# Altium schematic sheet Sensor.SchDoc: Transiently Powered Computers
size Letter; Author: Hrishikesh Jayakumar; DrawnBy: 2; Engineer: Hrishikesh; Organization: Embedded Systems Lab; Address1: 465 Northwestern Avenue; Address2: ECE Dept; Address3: Purdue University; Address4: West Lafayette, IN 47907; DocumentNumber: 6; Revision: B; SheetNumber: 6; SheetTotal: 6; DocumentName: ISHIDDEN=T
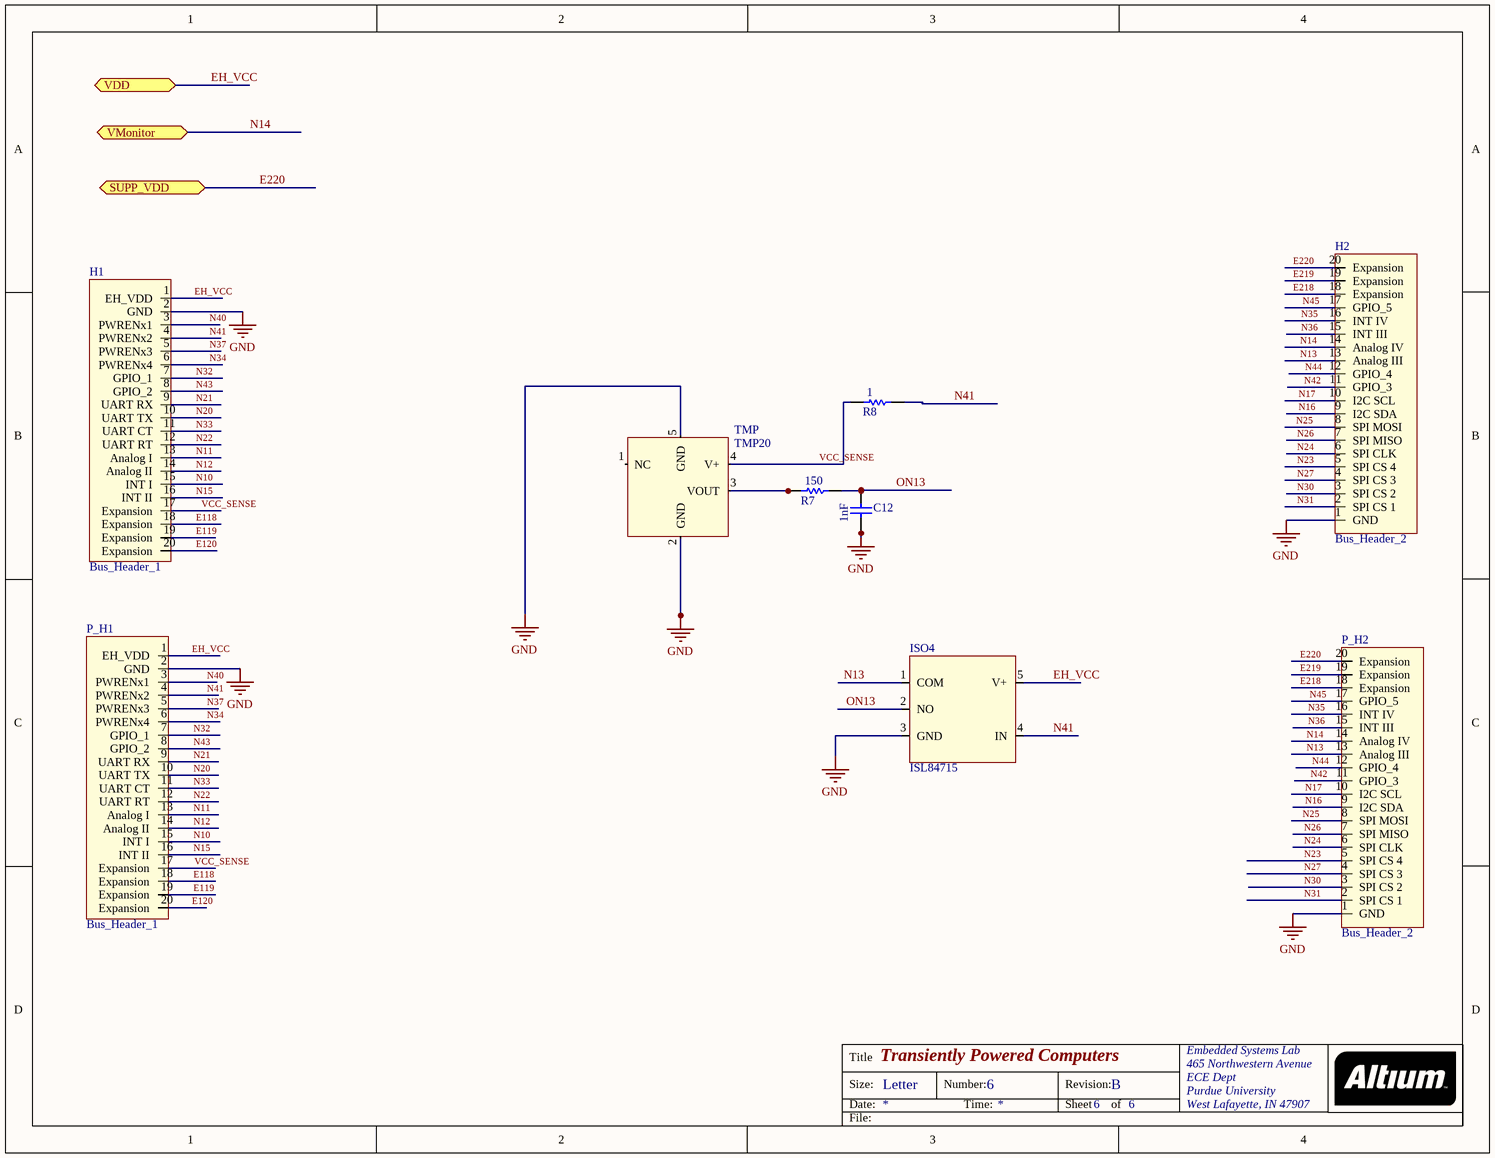
[diagram p0: Sensor.SchDoc]

## Parts
C12  value 1nF  [CAPC0402(1005)60_N]  (hidden comment: CAP 1uF 4V 0402(1005))
H1  Bus_Header_1  [Male Single row 20 pin header]
H2  Bus_Header_2  [Male Single row 20 pin header]
ISO4  ISL84715  [ISL84715]
P_H1  Bus_Header_1  [SMT 20 -pin single row female header]
P_H2  Bus_Header_2  [SMT 20 -pin single row female header]
R7  value 150  [RESC0805(2012)_M]  (hidden comment: 3R3 5% 0805(2012))
R8  value 1  [RESC0805(2012)_M]  (hidden comment: 3R3 5% 0805(2012))
TMP  TMP20  [TMP20]

## Ports
SUPP_VDD, VDD (bidir), VMonitor (bidir)

## Nets
GND: C12.1 H1.2(GND) H2.1(GND) ISO4.3(GND) P_H1.2(GND) P_H2.1(GND) TMP.2(GND) TMP.5(GND)
E118: H1.18(Expansion) P_H1.18(Expansion)
E119: H1.19(Expansion) P_H1.19(Expansion)
E120: H1.20(Expansion) P_H1.20(Expansion)
E218: H2.18(Expansion) P_H2.18(Expansion)
E219: H2.19(Expansion) P_H2.19(Expansion)
E220: H2.20(Expansion) P_H2.20(Expansion) ; port SUPP_VDD
EH_VCC: H1.1(EH_VDD) ISO4.5(V+) P_H1.1(EH_VDD) ; port VDD
N10: H1.15(INT_I) P_H1.15(INT_I)
N11: H1.13(Analog_I) P_H1.13(Analog_I)
N12: H1.14(Analog_II) P_H1.14(Analog_II)
N13: H2.13(Analog_III) ISO4.1(COM) P_H2.13(Analog_III)
N14: H2.14(Analog_IV) P_H2.14(Analog_IV) ; port VMonitor
N15: H1.16(INT_II) P_H1.16(INT_II)
N16: H2.9(I2C_SDA) P_H2.9(I2C_SDA)
N17: H2.10(I2C_SCL) P_H2.10(I2C_SCL)
N20: H1.10(UART_TX) P_H1.10(UART_TX)
N21: H1.9(UART_RX) P_H1.9(UART_RX)
N22: H1.12(UART_RT) P_H1.12(UART_RT)
N23: H2.5(SPI_CS_4) P_H2.5(SPI_CS_4)
N24: H2.6(SPI_CLK) P_H2.6(SPI_CLK)
N25: H2.8(SPI_MOSI) P_H2.8(SPI_MOSI)
N26: H2.7(SPI_MISO) P_H2.7(SPI_MISO)
N27: H2.4(SPI_CS_3) P_H2.4(SPI_CS_3)
N30: H2.3(SPI_CS_2) P_H2.3(SPI_CS_2)
N31: H2.2(SPI_CS_1) P_H2.2(SPI_CS_1)
N32: H1.7(GPIO_1) P_H1.7(GPIO_1)
N33: H1.11(UART_CT) P_H1.11(UART_CT)
N34: H1.6(PWRENx4) P_H1.6(PWRENx4)
N35: H2.16(INT_IV) P_H2.16(INT_IV)
N36: H2.15(INT_III) P_H2.15(INT_III)
N37: H1.5(PWRENx3) P_H1.5(PWRENx3)
N40: H1.3(PWRENx1) P_H1.3(PWRENx1)
N41: H1.4(PWRENx2) ISO4.4(IN) P_H1.4(PWRENx2) R8.1
N42: H2.11(GPIO_3) P_H2.11(GPIO_3)
N43: H1.8(GPIO_2) P_H1.8(GPIO_2)
N44: H2.12(GPIO_4) P_H2.12(GPIO_4)
N45: H2.17(GPIO_5) P_H2.17(GPIO_5)
ON13: C12.2 ISO4.2(NO) R7.1
VCC_SENSE: H1.17(Expansion) P_H1.17(Expansion) R8.2 TMP.4(V+)
NetR7_2: R7.2 TMP.3(VOUT)

Not connected (* = marked no-connect by the designer): TMP 1(NC)

## Notes on the sheet
- Title
- Size:
- Date:
- Letter
- Number:
- Time:
- Revision:
- Sheet
- of
- File:

## Library data of the parts
C12 = CMP-1034-02111-1: CAP 1uF 4V ±10% 0402 (1005 Metric) Thickness 0.6mm SMD; Case-Metric: 1005; Case-EIA: 0402; Max Thickness: 0.6 mm; Technology: SMT; Tolerance: ±10%; Rated Voltage: 4 V
R7 R8 = CMP-1013-00014-1: 3R3 0.125W 5% 0805 (2012 Metric)  SMD; Case-Metric: 2012; Case-EIA: 0805; Technology: SMT; Tolerance: 5 %; Power: 0.125 W